# EAGLE schematic Appelsiini_boost_converter (EAGLE 7.4.0)
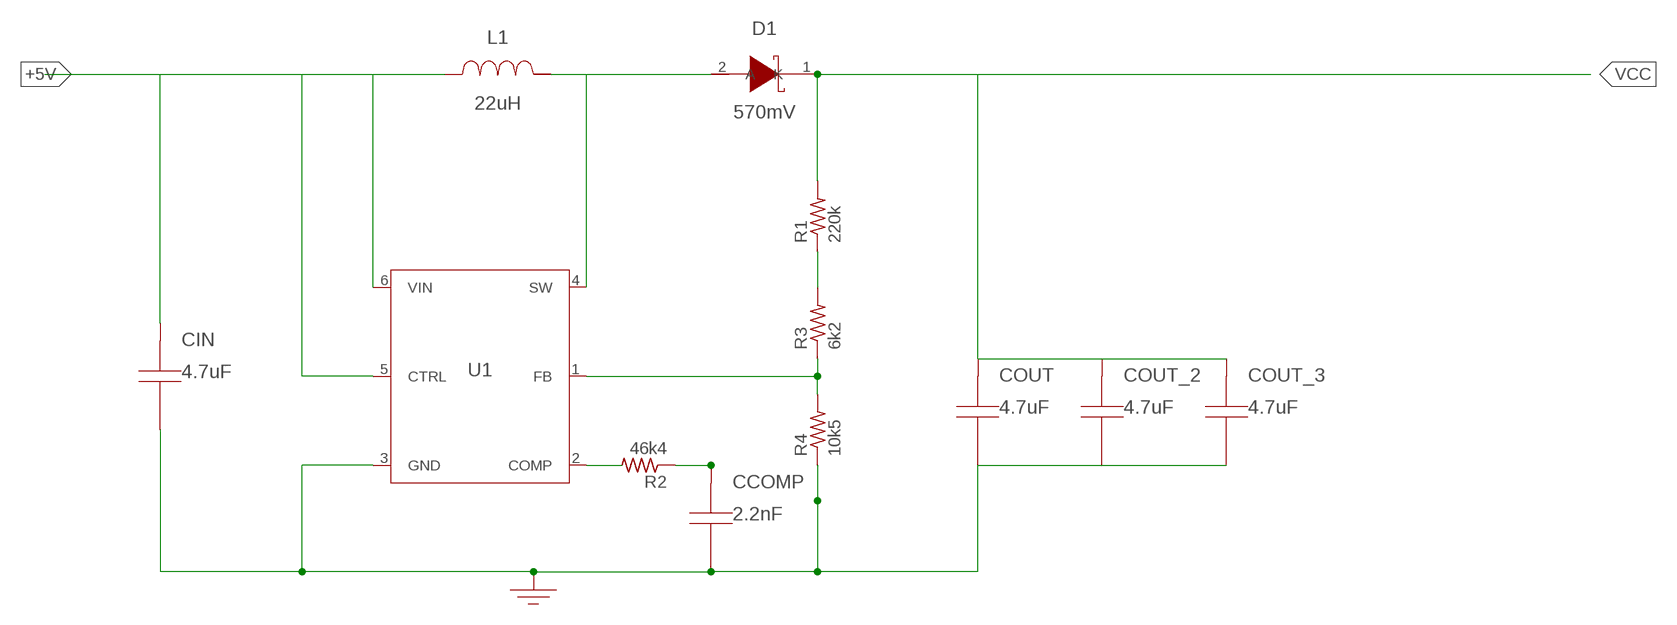
[diagram p0: schematic, sheet 1]

## Parts
CCOMP  2.2nF  CC0805KRX7R9BB222CC0805KRX7R9BB222  [0805]
CIN  4.7uF  GRM21BR61E475MA12LGRM21BR61E475MA12L  [0805]
COUT  4.7uF  GRM31CR71H475KA12LGRM31CR71H475KA12L  [1206]
COUT_2  4.7uF  GRM31CR71H475KA12LGRM31CR71H475KA12L  [1206]
COUT_3  4.7uF  GRM31CR71H475KA12LGRM31CR71H475KA12L  [1206]
D1  570mV  PMEG6010CEH,115PMEG6010CEH,115  [SOD-123F]
GND  WB_GND  WB_GNDWB_GND  [WB_GND]
L1  22uH  SRN6045-220MSRN6045-220M  [SRN6045]
R1  220k  R-US_M0805  [M0805]
R2  46k4  R-US_M0805  [M0805]
R3  6k2  R-US_M0805  [M0805]
R4  10k5  R-US_M0805  [M0805]
U1  TPS61170DRVR  TPS61170DRVRTPS61170DRVR  [S-PWSON-N6]

## Nets
0: CCOMP.2 CIN.2 COUT.2 COUT_2.2 COUT_3.2 GND.1 R4.1 U1.3(GND) U1.7(ETPAD)
1: CCOMP.1 R2.1
3: R3.1 R4.2 U1.1(FB)
7: D1.2(A) L1.2 U1.4(SW)
+5V: L1.1
INPUT: CIN.1 U1.5(CTRL)
N$1: COUT.1 COUT_3.1
N$2: R1.1 R3.2
N$3: U1.2(COMP)
N$5: U1.6(VIN)
VCC: COUT_2.1 D1.1(K) R1.2
Unconnected: R2.2

## Library data of the parts
CCOMP = AcceleratedDesigns_Lib:CC0805KRX7R9BB222; CAP: 2.2E-9; ESR: 0.0; IRMS: 0.0; MANUFACTURER_NAME: Yageo America; MANUFACTURER_PART_NUMBER: CC0805KRX7R9BB222; VDC: 50.0; VENDOR: Yageo America
CIN = AcceleratedDesigns_Lib:GRM21BR61E475MA12L; CAP: 4.7E-6; DATASHEET_URL: http://www.murata.com/products/catalog/pdf/c02e.pdf; ESR: 0.0020; IRMS: 7.29; MANUFACTURER_NAME: MuRata; MANUFACTURER_PART_NUMBER: GRM21BR61E475MA12L; VDC: 25.0; VENDOR: MuRata
COUT COUT_2 COUT_3 = AcceleratedDesigns_Lib:GRM31CR71H475KA12L; CAP: 4.7E-6; ESR: 0.0; IRMS: 0.0; MANUFACTURER_NAME: MuRata; MANUFACTURER_PART_NUMBER: GRM31CR71H475KA12L; VDC: 50.0; VENDOR: MuRata
D1 = AcceleratedDesigns_Lib:PMEG6010CEH,115; DATASHEET_URL: http://www.nxp.com/documents/data%5Fsheet/PMEG6010CEH%5FPMEG6010CEJ.pdf; IO: 1.0; MANUFACTURER_NAME: NXP Semiconductor; MANUFACTURER_PART_NUMBER: PMEG6010CEH,115; VENDOR: NXP Semiconductor; VFATIO: 0.57; VRRM: 60.0
GND = AcceleratedDesigns_Lib:WB_GND; MANUFACTURER_NAME: WB_GND; MANUFACTURER_PART_NUMBER: WB_GND; POWERPORTTYPE: POWER_GROUND; VALUE: Value
L1 = AcceleratedDesigns_Lib:SRN6045-220M; DATASHEET_URL: http://www.bourns.com/data/global/pdfs/SRN6045.pdf; DCR: 0.142; IDC: 1.5; L: 2.2E-5; MANUFACTURER_NAME: Bourns; MANUFACTURER_PART_NUMBER: SRN6045-220M; VENDOR: Bourns
R1-R4 = resistor:R-US_: RESISTOR, American symbol
U1 = AcceleratedDesigns_Lib:TPS61170DRVR; DATASHEET_URL: http://www.ti.com/product/tps61170; FREQUENCY: 1200000.0; IMAX: 1.2; MANUFACTURER_NAME: Texas Instruments; MANUFACTURER_PART_NUMBER: TPS61170DRVR; MKTG_PACKAGE: TPS61170; NSID: TPS61170DRVR; PACKAGE: TPS61170; VENDOR: Texas Instruments